# EAGLE design BreaV4B (EAGLE 7.7.0)
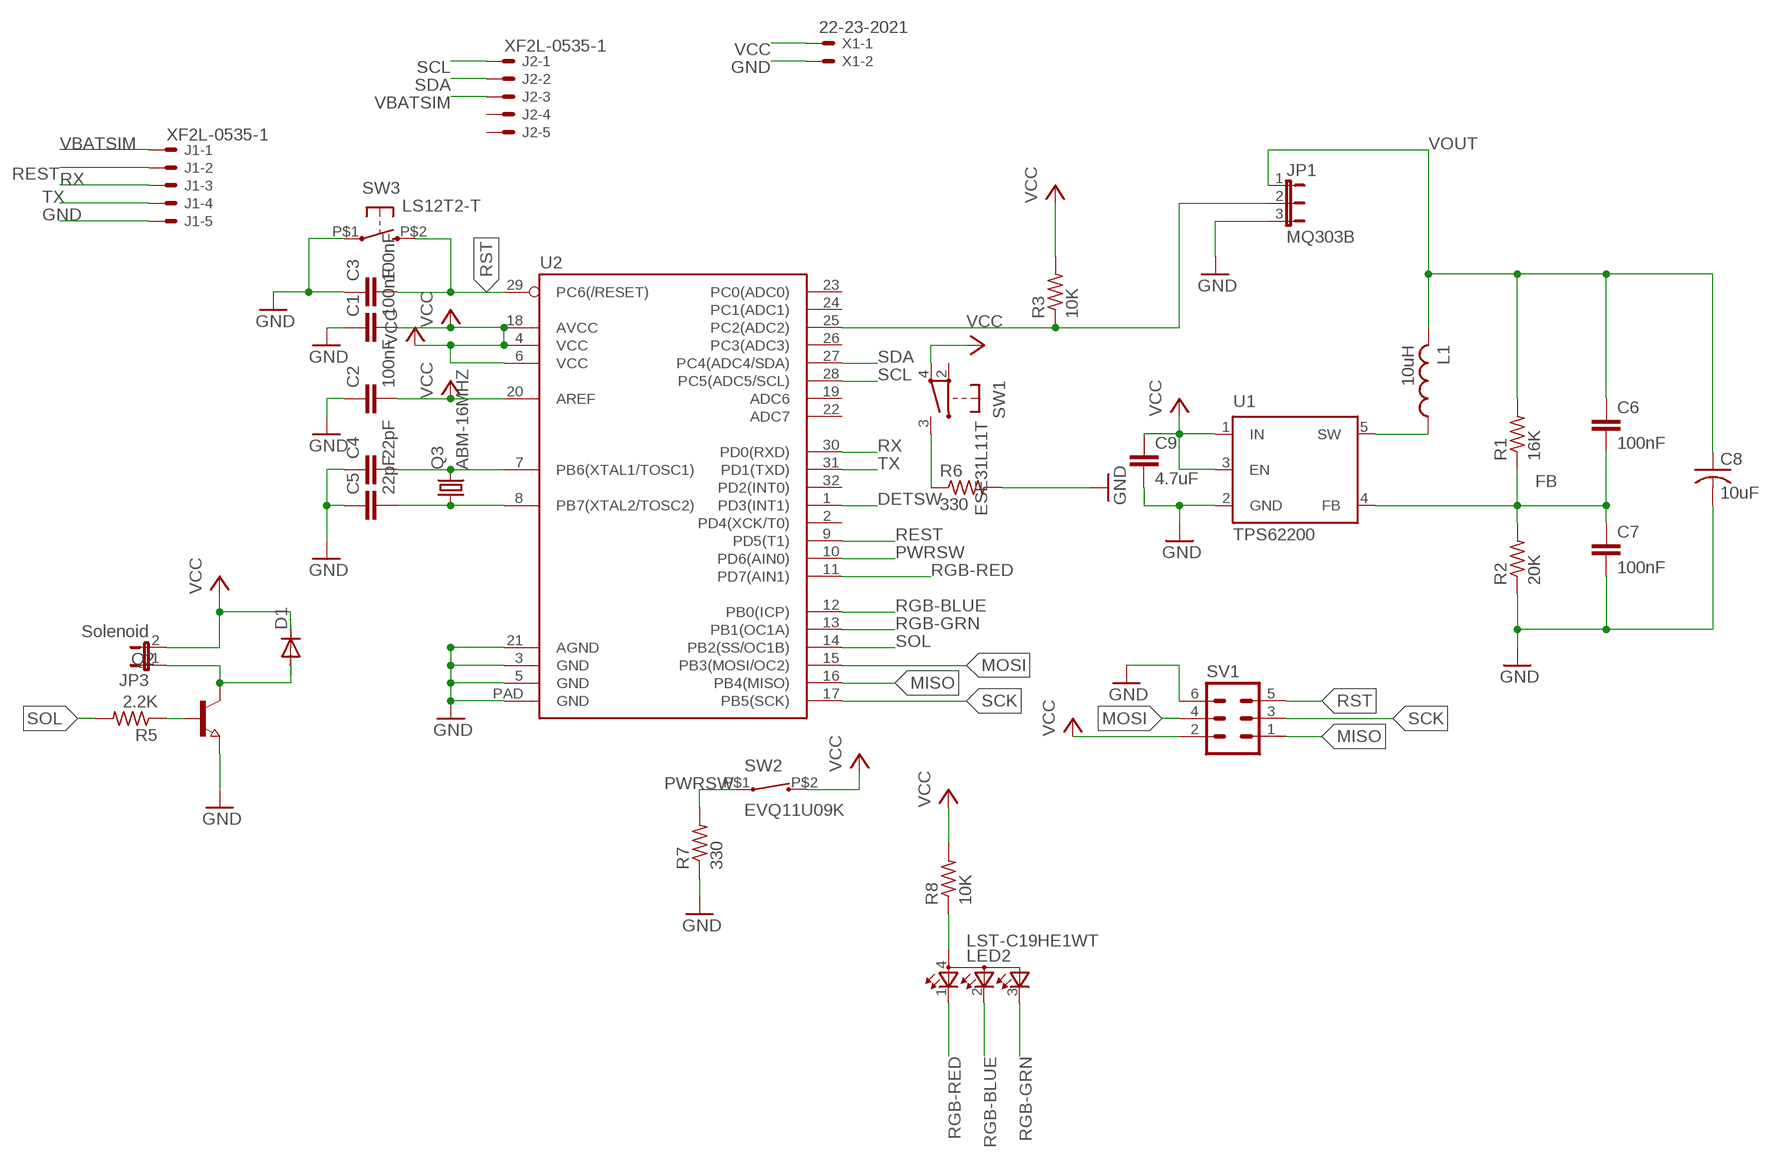
[diagram p0: schematic, sheet 1]

## Parts
C1  100nF  C-EUC0603  [C0603]
C2  100nF  C-EUC0603  [C0603]
C3  100nF  C-EUC0603  [C0603]
C4  22pF  C-EUC0603  [C0603]
C5  22pF  C-EUC0603  [C0603]
C6  100nF  C-EUC0402  [C0402]
C7  100nF  C-EUC0402  [C0402]
C8  10uF  C-USC0805K  [C0805K]
C9  4.7uF  C-EUC0402  [C0402]
D1  DIODE-SOD123  [SOD123]
J1  XF2L-0535-1  [XF2L-0535-1]
J2  XF2L-0535-1  [XF2L-0535-1]
JP1  MQ303B  JP2E  [JP2]
JP3  Solenoid  JP1E  [JP1]
L1  10uH  L-USL2825P  [L2825P]
LED2  LST-C19HE1WT  [LST-C19HE1WT]
Q2  NPN-TRANSISTOR_SOT23  [SOT23]
Q3  ABM-16MHZ  [ABM-16MHZ]
R1  16K  R-US_R0402  [R0402]
R2  20K  R-US_R0402  [R0402]
R3  10K  R-US_R0402  [R0402]
R5  2.2K  R-US_R0402  [R0402]
R6  330  R-US_R0402  [R0402]
R7  330  R-US_R0402  [R0402]
R8  10K  R-US_R0402  [R0402]
SV1  MA03-2  [MA03-2]
SW1  ESE31L11T  [SWITCH]
SW2  EVQ11U09K  [EVQ11U-09K]
SW3  LS12T2-T  [LS12T2-T]
U1  TPS62200  [TPS62200]
U2  ATMEGA328P_MLFMLF32  [MLF32-PAD]
X1  22-23-2021  [22-23-2021]

## Nets
DETSW: R6.1 SW1.3 U2.1(PD3(INT1))
FB: C6.2 C7.1 R1.1 R2.2 U1.4(FB)
GND: C1.1 C2.1 C3.1 C4.1 C5.1 C7.2 C8.2 C9.2 J1.5 JP1.3 Q2.2(E) R2.1 R6.2 R7.1 SV1.6(MISO) SW3.P$1(S1) U1.2(GND) U2.3(GND) U2.5(GND) U2.21(AGND) U2.PAD(GND) X1.2
MISO: SV1.1 U2.16(PB4(MISO))
MOSI: SV1.4 U2.15(PB3(MOSI/OC2))
N$1: C5.2 Q3.P$1 U2.8(PB7(XTAL2/TOSC2))
N$2: C4.2 Q3.P$2 U2.7(PB6(XTAL1/TOSC1))
N$3: JP1.2 R3.1 U2.25(PC2(ADC2))
N$5: LED2.4(A) R8.1
N$9: D1.A JP3.1 Q2.3(C)
N$10: Q2.1(B) R5.1
PWRSW: R7.2 SW2.P$1 U2.10(PD6(AIN0))
REST: J1.2 U2.9(PD5(T1))
RGB-BLUE: LED2.2(CGREEN) U2.12(PB0(ICP))
RGB-GRN: LED2.3(CBLUE) U2.13(PB1(OC1A))
RGB-RED: LED2.1(CRED) U2.11(PD7(AIN1))
RST: C3.2 SV1.5(VTG) SW3.P$2(S2) U2.29(PC6(/RESET))
RX: J1.3 U2.30(PD0(RXD))
SCK: SV1.3 U2.17(PB5(SCK))
SCL: J2.1 U2.28(PC5(ADC5/SCL))
SDA: J2.2 U2.27(PC4(ADC4/SDA))
SOL: R5.2 U2.14(PB2(SS/OC1B))
SW: L1.1 U1.5(SW)
TX: J1.4 U2.31(PD1(TXD))
VBATSIM: J1.1 J2.3
VCC: C1.2 C2.2 C9.1 D1.C JP3.2 R3.2 R8.2 SV1.2 SW1.4(C3) SW2.P$2 U1.1(IN) U1.3(EN) U2.4(VCC) U2.6(VCC) U2.18(AVCC) U2.20(AREF) X1.1
VOUT: C6.1 C8.1 JP1.1 L1.2 R1.2
Unconnected: J2.4 J2.5 SW1.2(C2) U2.2(PD4(XCK/T0)) U2.19(ADC6) U2.22(ADC7) U2.23(PC0(ADC0)) U2.24(PC1(ADC1)) U2.26(PC3(ADC3)) U2.32(PD2(INT0))

## Library data of the parts
C1-C7 C9 = rcl:C-EU: CAPACITOR, European symbol
C8 = resistor:C-US: CAPACITOR, American symbol
D1 = diode:DIODE-: DIODE
J1 J2 = adafruit:XF2*-05?: OMRON FPC Connector Source : http://www.omron.com/ecb/products/pdf/fpc.pdf
JP1 = jumper:JP2E: JUMPER
JP3 = jumper:JP1E: JUMPER
L1 = resistor:L-US: INDUCTOR, American symbol
LED2 = led:LST-C19HE1WT
Q2 = semicon-smd-ipc:NPN-TRANSISTOR_: NPN TRANSISTOR
Q3 = NewPart:ABM-16MHZ: Crystal 16MHz 18pF
R1-R3 R5-R8 = resistor:R-US_: RESISTOR, American symbol
SV1 = con-lstb:MA03-2: PIN HEADER; OC_FARNELL: unknown; OC_NEWARK: unknown
SW1 = NewPart:ESE31L11T: Panasonic Detector Switch
SW2 = NewPart:EVQ11U09K
SW3 = NewPart:LS12T2-T: Side Switch for hardware reset
U1 = NewPart:TPS62200: TI TPS62200 Buck Converter
U2 = SparkFun-DigitalIC:ATMEGA328P_MLF: 32-Pin Atmega328 part Commonly used on Arduino compatible boards Available in QFP and QFN packages TQFP is IC-09069 QFN is non-stock
X1 = con-molex:22-23-2021: .100" (2.54mm) Center Header - 2 Pin; MF: MOLEX; MPN: 22-23-2021; OC_FARNELL: 1462926; OC_NEWARK: 25C3832

## Board
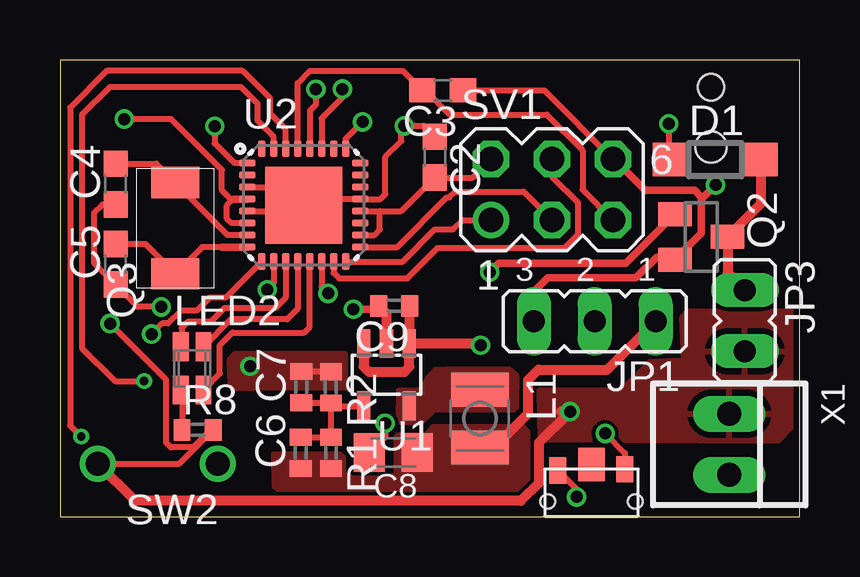
[diagram p1: board, top side]
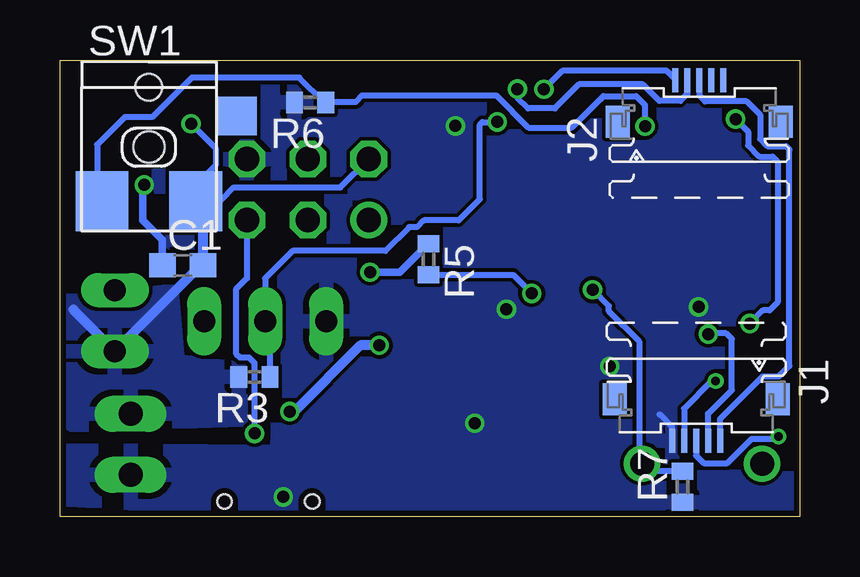
[diagram p2: board, bottom side, seen from below]

Size 30.83 x 19.04 mm. Coordinates in mm from the lower left corner, seen from the top.
Outline: 30.83,0 0,0 0,19.03 30.83,19.03
Outline: 30.83,0 30.83,0
Outline: 30.83,0 30.83,19.03
Outline: 30.83,19.03 30.83,19.04
Copper layers (1*16): Top 0.035mm / dielectric 1.5mm / Bottom 0.035mm
Design rules "SeeedStudio_2layer_DRU_no_angle_20140221": minimum track width 6mil, minimum drill 12mil, track to track 6mil, track to pad 6mil, pad to pad 6mil, via to via 6mil, smd to smd 0mil, copper to edge 10mil, drill to drill 10mil, minimum pad ring 10mil, minimum via ring 6mil, stop-mask expansion 2mil, vias tented up to drill 100mil, thermal gap 10mil

### Footprints (pad centres in the part's own frame; a part is rotated, then mirrored left to right if it is on the bottom)
C0603 = smd 1.1 x 1: 1 -0.85,0; 2 0.85,0
C0402 = smd 0.7 x 0.9: 1 -0.65,0; 2 0.65,0
C0805K = smd 1.3 x 1.6: 1 -1,0; 2 1,0
SOD123 = smd 1.4 x 1.4: A 1.9,0; C -1.9,0
XF2L-0535-1 = smd 1 x 0.25: 1 1.905,1; 2 1.905,0.5; 3 1.905,0; 4 1.905,-0.5; 5 1.905,-1 | smd 1.34 x 1: M1 0.18,3.388; M2 0.18,-3.388
JP2 = drill 0.914 long: 1 -2.54,0; 2 0,0; 3 2.54,0
JP1 = drill 0.914 long: 1 0,-1.27; 2 0,1.27
L2825P = smd 1.4 x 2.4: 1 -1.2,0; 2 1.2,0
LST-C19HE1WT = smd 0.65 x 1.2: 1 -0.475,0.9; 2 0.475,0.9; 3 0.475,-0.9; 4 -0.475,-0.9
SOT23 = smd 1 x 1.4: 1 -0.95,-1.1; 2 0.95,-1.1; 3 0,1.1
ABM-16MHZ = smd 1.3 x 2: P$1 0.6,-1.6; P$2 4.4,-1.6
R0402 = smd 0.7 x 0.9: 1 -0.65,0; 2 0.65,0
MA03-2 = drill 1.016: 1 -2.54,-1.27 | drill 1.016 octagon: 2 -2.54,1.27; 3 0,-1.27; 4 0,1.27; 5 2.54,-1.27; 6 2.54,1.27
SWITCH = smd 1.7 x 1.6: 2 3.65,1.3 | smd 2.2 x 2.5: 3 -1.95,-2.25; 4 1.95,-2.25 | hole 1.1: 0,2.5 | hole 1.3: 0,0
EVQ11U-09K = drill 1: P$1 -2.5,0; P$2 2.5,0
LS12T2-T = smd 1.1 x 0.7: P$1 0.05,-1.41; P$2 0,1.39 | smd 1.4 x 1.1: P$3 -0.2,0 | hole 0.6: 1.35,-1.825; 1.35,1.825
TPS62200 = smd 0.55 x 1.2: 1 -0.95,-1.3; 2 0,-1.3; 3 0.95,-1.3; 4 0.95,1.3; 5 -0.95,1.3
MLF32-PAD = smd 0.7 x 0.3: 1 -2.35,1.75; 2 -2.35,1.25; 3 -2.35,0.75; 4 -2.35,0.25; 5 -2.35,-0.25; 6 -2.35,-0.75; 7 -2.35,-1.25; 8 -2.35,-1.75; 17 2.35,-1.75; 18 2.35,-1.25; 19 2.35,-0.75; 20 2.35,-0.25; 21 2.35,0.25; 22 2.35,0.75; 23 2.35,1.25; 24 2.35,1.75 | smd 0.3 x 0.7: 9 -1.75,-2.35; 10 -1.25,-2.35; 11 -0.75,-2.35; 12 -0.25,-2.35; 13 0.25,-2.35; 14 0.75,-2.35; 15 1.25,-2.35; 16 1.75,-2.35; 25 1.75,2.35; 26 1.25,2.35; 27 0.75,2.35; 28 0.25,2.35; 29 -0.25,2.35; 30 -0.75,2.35; 31 -1.25,2.35; 32 -1.75,2.35 | smd 3.2 x 3.2: PAD 0,0
22-23-2021 = drill 1 long: 1 -1.27,0; 2 1.27,0

### Placement (x,y rotation side)
C1  25.71,10.48 0 bottom
C2  15.61,14.99 270 top
C3  15.94,17.77 180 top
C4  2.31,13.87 90 top
C5  2.31,10.53 90 top
C6  10.03,2.67 90 top
C7  10.05,5.41 90 top
C8  13.88,2.69 180 top
C9  13.93,8.8 180 top
D1  27.3,14.89 0 top
J1  4.32,5.09 270 bottom
J2  4.19,16.29 90 bottom
JP1  22.28,8.15 180 top
JP3  28.54,8.18 180 top
L1  17.5,4.1 270 top
LED2  5.51,6.19 0 top
Q2  26.72,11.67 270 top
Q3  3.21,9.53 90 top
R1  11.29,2.67 270 top
R2  11.29,5.4 270 top
R3  22.72,5.83 180 bottom
R5  15.47,10.74 270 bottom
R6  20.41,17.27 180 bottom
R7  4.89,1.26 90 bottom
R8  5.74,3.63 0 top
SV1  20.5,13.64 0 top
SW1  27.12,15.41 0 bottom
SW2  4.08,2.22 180 top
SW3  22.15,1.99 270 top
U1  13.61,5.93 180 top
U2  10.16,12.99 0 top
X1  27.88,3.03 270 top

### Tracks (layer width: path | path; a pad name or v marks a point on that pad's centre or on a via)
DETSW  (via drill 0.5)
  Top 0.254: U2.1 7.27,14.74 6.45,15.57 v6.45,16.28
  Bottom 0.254: SW1.3 29.28,13.36 29.28,15.51 28.13,16.66 26.99,16.66 25.34,18.31 20.86,18.31 19.82,17.27 R6.1 19.74,17.29 18.51,17.29 18.23,17.57 12.65,17.57 11.31,16.22 9.51,16.22 8.34,17.39 8.33,17.39 8.19,17.53 6.82,17.53 6.46,17.17 v6.46,16.29 v6.45,16.28
FB
  Top 0.254: 10.97,4.68 R2.2 | R2.2 11.04,4.61 12.64,4.61 U1.4 | R2.2 10.07,4.75 C7.1 | C6.2 R1.1 11.29,4.74 R2.2
GND  (via drill 0.5)
  Top 0.254: U2.3 9.41,13.74 U2.PAD | U2.5 9.91,12.74 U2.PAD | U2.PAD 10.41,13.24 U2.21 13.35,13.24 13.56,13.45 13.56,15 14.22,15.66 14.22,16.17 v14.35,16.3 15.16,16.3 C2.1 | C3.1 20.18,17.77 SV1.6 | C8.2 12.78,2.83 | C8.2 12.64,3.09 | C4.1 1.76,13.02 1.42,12.67 1.42,10.58 C5.1 3.24,8.75 v4.22,8.75 | SW3.P$1 21.53,1.15 v21.53,0.83 | R2.1 10.07,6.04 C7.2 10.02,6.09 | v13.55,3.9 13.55,3.35 C8.2
  Top 0.305: SV1.6 23.09,14.91 24.39,13.61 26.45,13.61 26.73,13.33 26.73,13.24 | v12.23,8.65 13.14,8.65 C9.2 | Q2.2 | 26.73,13.24 26.73,11.83 Q2.2 | JP1.3 19.74,9.39 20.32,9.97 24,9.97 24.86,10.83 25.5,10.83 Q2.2 | 26.73,13.24 v27.32,13.83
  Top 0.406: C9.2 13.45,8.8 | 13.4,8.68 C9.2 | U1.2 13.61,8.47 C9.2
  Bottom 0.254: J1.5 5.32,3.74 5.85,4.27
  Bottom 0.305: C1.1 26.56,11.54 27.38,12.36 27.38,13.77 v27.32,13.83
  other vias: 7.92,6.28
  pour Top (no thermals): 7.29,6.79 11.87,6.79 11.87,5.37 8.89,5.37 7.27,5.35 7.12,5.5 7.08,6.57
  pour Bottom: 0.25,18.96 29.97,18.96 30.09,18.84 30.09,15.66 29.71,15.28 26.67,15.28 26.83,14.75 26.19,11.43 23.45,10.25 23.11,7.28 21.69,6.64 21.77,2.72 30.5,2.78 30.44,0.71 21.2,0.17 0.5,0.17 0.25,0.42
MISO
  Top 0.254: U2.16 14.28,10.64 15.62,11.98 16.38,11.98 16.77,12.37 SV1.1
MOSI
  Top 0.254: U2.15 11.41,10.17 11.63,9.95 14.47,9.95 15.74,11.22 21.03,11.22 21.59,11.77 21.59,13.1 20.52,14.16 20.52,14.89 SV1.4
N$1
  Top 0.254: 6.74,11.24 5.92,11.24 Q3.P$1 3.56,11.38 C5.2
  Top 0.305: U2.8 6.74,11.24
N$2
  Top 0.254: U2.7 7,11.74 Q3.P$2 4.02,14.72 C4.2
N$3  (via drill 0.5)
  Top 0.254: U2.25 11.91,15.75 v12.61,16.46
  Bottom 0.254: R3.1 22.07,7.95 JP1.2 22.28,9.95 21.14,11.09 17.27,11.09 16.28,12.08 15.95,12.08 15.67,12.36 14.22,12.36 13.33,13.25 13.33,16.34 13.23,16.45 v12.62,16.45 v12.61,16.46
N$5
  Top 0.254: LED2.4 5.09,5.24 R8.1
N$9
  Top 0.406: JP3.1 27.82,10.17 Q2.3 29.2,13.05 D1.A
N$10  (via drill 0.5)
  Top 0.305: v17.9,10.2 18.28,10.58 23.58,10.58 Q2.1
  Bottom 0.305: v17.9,10.2 16.66,10.2 R5.1
PWRSW  (via drill 0.5)
  Top 0.254: U2.10 8.91,9.74 v8.63,9.46
  Bottom 0.254: v8.63,9.46 7.96,8.79 7.96,8.58 6.7,7.32 6.7,2.34 SW2.P$1 6.27,1.91 R7.2
REST  (via drill 0.5)
  Top 0.254: U2.9 6.9,9.14 6.24,9.14 5.7,8.6 5.03,8.6 4.5,8.07 4.27,8.07 v3.82,7.62
  Bottom 0.254: J1.2 3.82,4.31 2.84,5.29 2.84,7.42 3.07,7.65 3.79,7.65 v3.82,7.62
RGB-BLUE
  Top 0.254: U2.12 9.91,8.67 9.47,8.23 7.12,8.23 LED2.2
RGB-GRN
  Top 0.254: LED2.3 6.67,5.97 6.67,7.16 7.19,7.68 10.18,7.68 10.41,7.91 U2.13
RGB-RED
  Top 0.254: U2.11 9.41,9.14 8.97,8.7 6.85,8.7 6.28,8.13 5.32,8.13 5.07,7.88 5.07,7.12 LED2.1
RST  (via drill 0.5)
  Top 0.254: 15.04,17.82 C3.2 | U2.29 9.91,18.08 10.41,18.58 14.28,18.58 C3.2 | C3.2 15.24,17.77 16.25,16.76 20.29,16.76 21.78,15.27 21.78,13.63 SV1.5 | v22.72,3.48 23.54,2.66 SW3.P$2
  Bottom 0.254: SV1.5 23.04,9.94 23.48,9.51 23.48,6.79 23.33,6.64 22.95,6.64 22.72,6.41 v22.72,3.48
RX  (via drill 0.35)
  Top 0.254: U2.30 9.39,15.36 9.39,16.17 8.76,16.8 8.76,17.44 7.61,18.59 1.96,18.59 0.43,17.06 0.43,3.81 v0.89,3.35
  Bottom 0.254: J1.3 4.32,2.55 4.01,2.24 3.02,2.24 2,3.25 0.98,3.25 v0.89,3.35
SCK
  Top 0.254: U2.17 14.04,11.24 16.11,13.31 16.23,13.31 16.47,13.55 19.32,13.55 SV1.3
SCL  (via drill 0.5)
  Top 0.254: v10.66,17.82 10.66,17.18 10.41,16.93 U2.28
  Bottom 0.254: J2.1 5.19,18.24 5.54,18.59 9.89,18.59 v10.66,17.82
SDA  (via drill 0.5)
  Top 0.254: U2.27 10.91,16.61 11.77,17.47 v11.77,17.83
  Bottom 0.254: J2.2 4.69,17.63 4.98,17.34 5.86,17.34 6.54,18.02 9.21,18.02 10.21,17.02 11.32,17.02 11.77,17.47 v11.77,17.83
SOL  (via drill 0.5)
  Top 0.254: U2.14 10.91,9.58 v11.17,9.31
  Bottom 0.254: R5.2 11.95,10.09 v11.17,9.31
SW
  pour Top (no thermals): 14.19,5.27 14.12,5.26 14.1,4.05 14.25,3.94 15.03,3.96 15.32,4.22 15.59,4.48 15.95,4.49 18.86,4.46 19.02,4.6 19.03,5.88 18.75,6.13 16.45,6.15 15.65,6.12 15.34,5.79 15.07,5.28
TX  (via drill 0.35)
  Top 0.254: U2.31 8.91,15.84 8.23,16.52 8.23,17.23 7.54,17.92 2.09,17.92 0.92,16.75 0.92,7.04 2.3,5.66 v3.5,5.66 v3.51,5.67
  Bottom 0.254: J1.4 4.82,4.52 3.67,5.67 v3.51,5.67
VBATSIM
  Bottom 0.254: J2.3 4.19,17.56 3.95,17.32 2.22,17.32 1.66,16.76 1.66,15.75 1.36,15.45 0.57,15.45 0.43,15.31 0.44,15.3 0.44,6.3 0.88,5.86 1.54,5.86 1.71,5.7 3.32,4.09 J1.1
VCC  (via drill 0.5)
  Top 0.254: U2.20 13.34,12.74 | U2.18 13.1,11.74 13.33,11.98 13.33,12.74 13.34,12.74 | U2.6 7.15,12.24 6.96,12.43 6.96,12.99 7.21,13.24 | 13.34,12.74 14.21,12.74 C2.2 17.2,14.14 SV1.2 | v25.37,16.38 25.37,14.93 D1.C | U2.4 7.11,13.24 6.75,13.61 6.75,14.46 4.63,16.58 v2.68,16.58 | SW2.P$2 4.98,2.22 R8.2 6.28,3.63 5.55,2.9 4.62,2.9 4.43,3.09 4.43,5.72 v2.09,8.06
  Top 0.305: U2.4 7.21,13.24
  Top 0.406: 14.64,8.74 C9.1 14.56,8.77 U1.1 | 20.87,4.39 v21.25,4.39 19.97,3.11 19.97,1.43 19.21,0.67 3.13,0.67 SW2.P$2 | U1.3 12.66,6.26 12.87,6.05 14.35,6.05 14.56,6.26 U1.1 | U1.1 17.44,7.23 v17.52,7.15
  Bottom 0.254: SV1.2 19.14,13.73 23.58,13.73 24.12,13.2 25.13,13.2 SW1.4 | v25.37,16.38 24.33,15.34 24.33,14.68 25.17,13.83 | v2.68,16.58 2.16,16.06 2.16,15.48 1.69,15.01 1.14,15.01 0.93,14.8 0.93,8.94 1.26,8.61 1.54,8.61 v2.09,8.06
  Bottom 0.406: v17.52,7.15 18.31,7.15 21.07,4.39 v21.25,4.39 | 25.17,13.83 SW1.4 24.86,12.84 24.86,10.59 | 30.27,8.64 JP3.2 24.86,10.59 | C1.2 24.86,10.59
  pour Bottom: 22.98,6.13 25.93,6.49 26.17,9.42 29.14,9.06 30.47,9.21 30.44,5.75 30.52,5.74 30.41,3.96 30.29,3.83 23.22,4.06 23.01,4.43 22.98,3.75
  pour Top: 26.17,8.57 30.46,8.57 30.46,3.72 29.9,3.16 20.03,3.21 19.99,5.27 23.46,5.3 24.64,6.48 26.02,6.52 25.94,8.33
VOUT
  Top 0.406: JP1.1 22.8,6.14 19.93,6.14 19.5,5.7 19.5,4.3 18.08,2.88 L1.2 17.46,2.65
  pour Top (no thermals): 8.93,2.62 11.63,2.61 11.78,2.48 11.77,1.87 11.91,1.7 13.86,1.69 14.03,1.75 14.03,3.36 14.09,3.41 15.3,3.43 15.55,3.76 15.82,3.76 19.29,3.75 19.48,3.54 19.5,1.2 19.12,0.92 9.4,0.89 8.95,1.29